# Altium project kkk51.PrjPCB
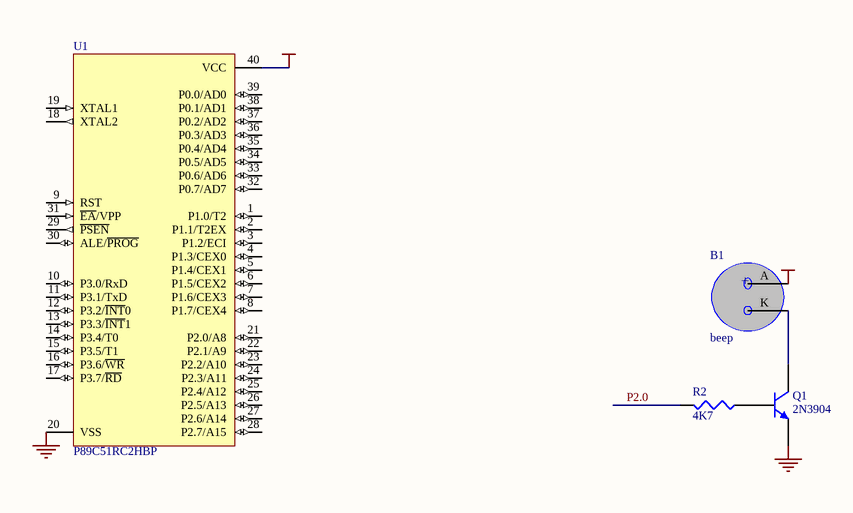
[diagram p0: kkk51.SchDoc]
1 sheet, 4 parts. Net scope: global (net labels, ports and power ports of the same name join across sheets).

## Sheet kkk51.SchDoc
size A4

### Parts
B1  beep  [B7/12/.8]
Q1  2N3904  [TO-92A]
R2  value 4K7  [c0805]
U1  P89C51RC2HBP  [SOT129-1]

### Nets
GND: Q1.1(E) U1.20(VSS)
VCC: B1.A U1.40(VCC)
P2.0: R2.2
NetB1_K: B1.K Q1.3(C)
NetQ1_2: Q1.2(B) R2.1

Not connected (* = marked no-connect by the designer): U1 1(P1.0/T2) 2(P1.1/T2EX) 3(P1.2/ECI) 4(P1.3/CEX0) 5(P1.4/CEX1) 6(P1.5/CEX2) 7(P1.6/CEX3) 8(P1.7/CEX4) 9(RST) 10(P3.0/RxD) 11(P3.1/TxD) 12(P3.2/~{INT}0) 13(P3.3/~{INT}1) 14(P3.4/T0) 15(P3.5/T1) 16(P3.6/~{WR}) 17(P3.7/~{RD}) 18(XTAL2) 19(XTAL1) 21(P2.0/A8) 22(P2.1/A9) 23(P2.2/A10) 24(P2.3/A11) 25(P2.4/A12) 26(P2.5/A13) 27(P2.6/A14) 28(P2.7/A15) 29(~{PSEN}) 30(ALE/~{PROG}) 31(~{EA}/VPP) 32(P0.7/AD7) 33(P0.6/AD6) 34(P0.5/AD5) 35(P0.4/AD4) 36(P0.3/AD3) 37(P0.2/AD2) 38(P0.1/AD1) 39(P0.0/AD0)

### Notes on the sheet
- (in symbol beep) +

### Library data of the parts
Q1 = 2N3904: NPN General Purpose Amplifier; Published: 8-Jun-2000; LatestRevisionDate: 15-Jan-2003; LatestRevisionNote: PCB Footprint 'BCY-W3/D4.7' replaced; DatasheetDocument: 1997; PackageDocument: Sep-1998; PackageReference: TO-92A; Publisher: Altium Limited; Code_JEDEC: TO-92A; ComponentLink1Description: Manufacturer Link; ComponentLink1URL: http://www.fairchildsemi.com/; ComponentLink2Description: Datasheet; ComponentLink2URL: http://www.fairchildsemi.com/ds/2N%2F2N3904.pdf
R2 = Res3: Resistor; Published: 8-Jun-2000; LatestRevisionDate: 04-Mar-2005; LatestRevisionNote: PCB Footprint replaced.; PackageReference: J1-0603; Publisher: Altium Limited
U1 = P89C51RC2HBP: 80C51 8-Bit Flash Microcontroller Family, 32 kB ISP/IAP Flash with 512 B RAM.; Package Information: Latest Revision: Aug-2000; Code - JEDEC: MO-015; Published: 21-May-2003; Datasheet: Latest Revision: 24-May-2002; Package Reference: SOT129-1; Publisher: Altium Limited